# Altium schematic sheet SOCPowerDecoupling.SchDoc
size A3; SheetNumber: 6; SheetTotal: 18
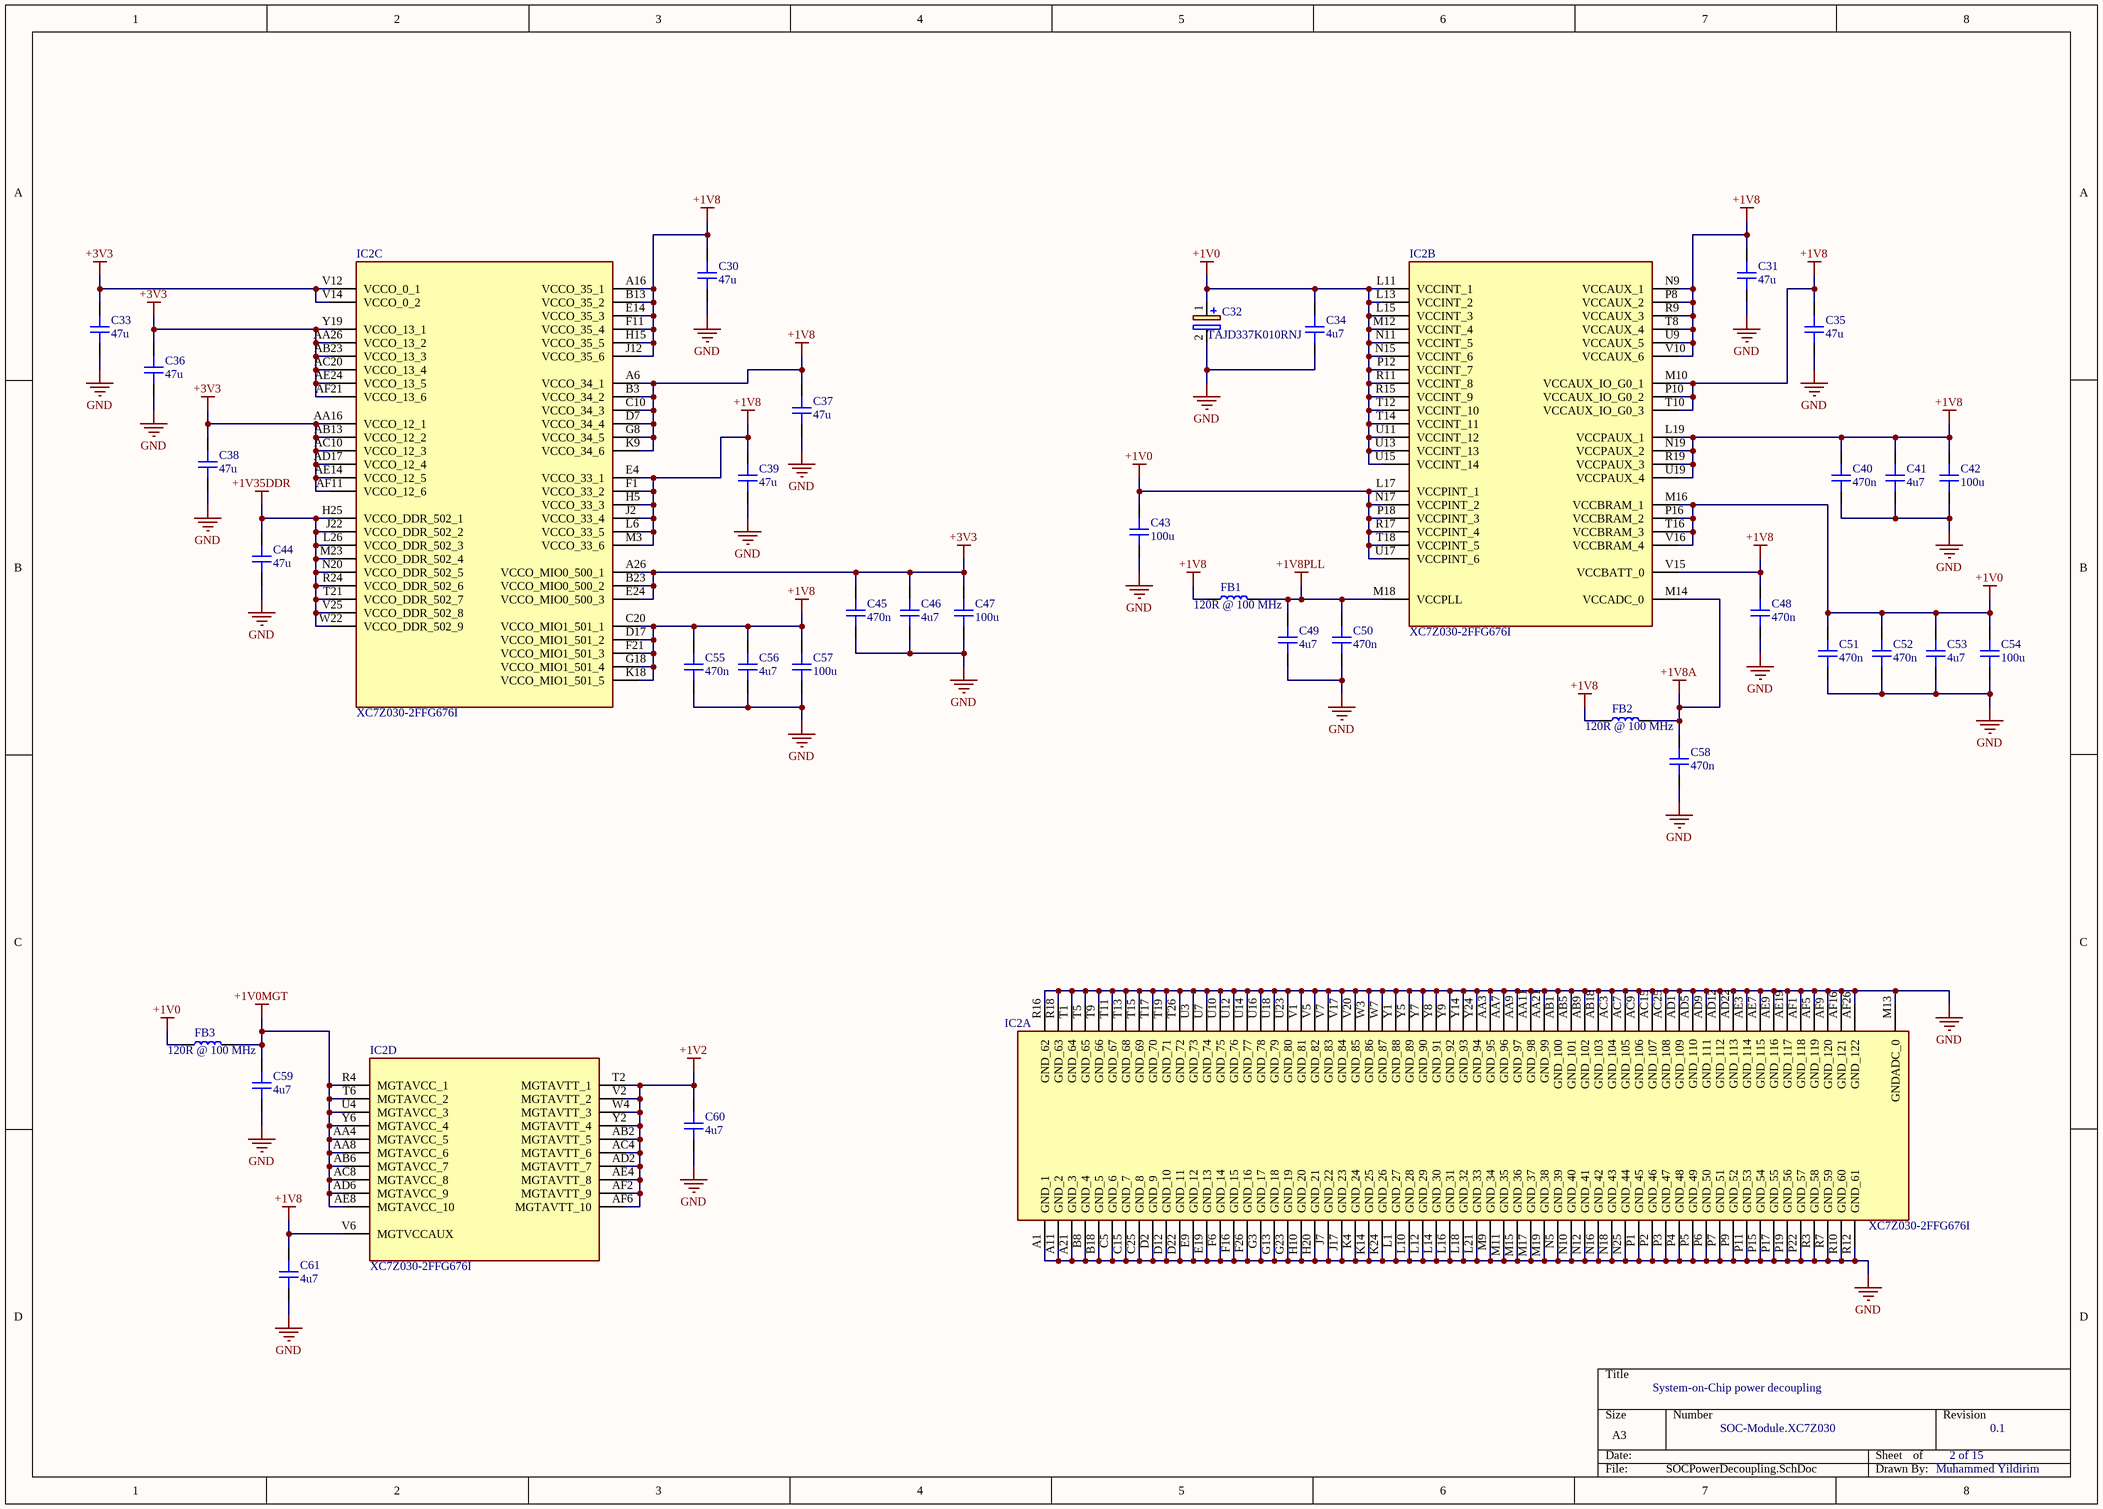
[diagram p0: SOCPowerDecoupling.SchDoc]

## Parts
C30  47u  [CAP_0805]
C31  47u  [CAP_0805]
C32  TAJD337K010RNJ  [CAPPM7344X310N]
C33  47u  [CAP_0805]
C34  4u7  [CAP_0402]
C35  47u  [CAP_0805]
C36  47u  [CAP_0805]
C37  47u  [CAP_0805]
C38  47u  [CAP_0805]
C39  47u  [CAP_0805]
C40  470n  [CAP_0201]
C41  4u7  [CAP_0402]
C42  100u  [CAP_1210]
C43  100u  [CAP_1210]
C44  47u  [CAP_0805]
C45  470n  [CAP_0201]
C46  4u7  [CAP_0402]
C47  100u  [CAP_1210]
C48  470n  [CAP_0201]
C49  4u7  [CAP_0402]
C50  470n  [CAP_0201]
C51  470n  [CAP_0201]
C52  470n  [CAP_0201]
C53  4u7  [CAP_0402]
C54  100u  [CAP_1210]
C55  470n  [CAP_0201]
C56  4u7  [CAP_0402]
C57  100u  [CAP_1210]
C58  470n  [CAP_0201]
C59  4u7  [CAP_0402]
C60  4u7  [CAP_0402]
C61  4u7  [CAP_0402]
FB1  120R @ 100 MHz  [IND_0201]
FB2  120R @ 100 MHz  [IND_0201]
FB3  120R @ 100 MHz  [IND_0201]
IC2  XC7Z030-2FFG676I  [BGA676C100P26X26_2700X2700X324]  (parts A,B,C,D of 15)

## Nets
+1V0: C32.1(+) C34.2 C43.2 C51.2 C52.2 C53.2 C54.2 FB3.1 IC2.L11(VCCINT_1) IC2.L13(VCCINT_2) IC2.L15(VCCINT_3) IC2.L17(VCCPINT_1) IC2.M12(VCCINT_4) IC2.M16(VCCBRAM_1) IC2.N11(VCCINT_5) IC2.N15(VCCINT_6) IC2.N17(VCCPINT_2) IC2.P12(VCCINT_7) IC2.P16(VCCBRAM_2) IC2.P18(VCCPINT_3) IC2.R11(VCCINT_8) IC2.R15(VCCINT_9) IC2.R17(VCCPINT_4) IC2.T12(VCCINT_10) IC2.T14(VCCINT_11) IC2.T16(VCCBRAM_3) IC2.T18(VCCPINT_5) IC2.U11(VCCINT_12) IC2.U13(VCCINT_13) IC2.U15(VCCINT_14) IC2.U17(VCCPINT_6) IC2.V16(VCCBRAM_4)
+1V0MGT: C59.2 FB3.2 IC2.AA4(MGTAVCC_5) IC2.AA8(MGTAVCC_6) IC2.AB6(MGTAVCC_7) IC2.AC8(MGTAVCC_8) IC2.AD6(MGTAVCC_9) IC2.AE8(MGTAVCC_10) IC2.R4(MGTAVCC_1) IC2.T6(MGTAVCC_2) IC2.U4(MGTAVCC_3) IC2.Y6(MGTAVCC_4)
+1V2: C60.2 IC2.AB2(MGTAVTT_5) IC2.AC4(MGTAVTT_6) IC2.AD2(MGTAVTT_7) IC2.AE4(MGTAVTT_8) IC2.AF2(MGTAVTT_9) IC2.AF6(MGTAVTT_10) IC2.T2(MGTAVTT_1) IC2.V2(MGTAVTT_2) IC2.W4(MGTAVTT_3) IC2.Y2(MGTAVTT_4)
+1V8: C30.2 C31.2 C35.2 C37.2 C39.2 C40.2 C41.2 C42.2 C48.2 C55.2 C56.2 C57.2 C61.2 FB1.1 FB2.1 IC2.A6(VCCO_34_1) IC2.A16(VCCO_35_1) IC2.B3(VCCO_34_2) IC2.B13(VCCO_35_2) IC2.C10(VCCO_34_3) IC2.C20(VCCO_MIO1_501_1) IC2.D7(VCCO_34_4) IC2.D17(VCCO_MIO1_501_2) IC2.E4(VCCO_33_1) IC2.E14(VCCO_35_3) IC2.F1(VCCO_33_2) IC2.F11(VCCO_35_4) IC2.F21(VCCO_MIO1_501_3) IC2.G8(VCCO_34_5) IC2.G18(VCCO_MIO1_501_4) IC2.H5(VCCO_33_3) IC2.H15(VCCO_35_5) IC2.J2(VCCO_33_4) IC2.J12(VCCO_35_6) IC2.K9(VCCO_34_6) IC2.K18(VCCO_MIO1_501_5) IC2.L6(VCCO_33_5) IC2.L19(VCCPAUX_1) IC2.M3(VCCO_33_6) IC2.M10(VCCAUX_IO_G0_1) IC2.N9(VCCAUX_1) IC2.N19(VCCPAUX_2) IC2.P8(VCCAUX_2) IC2.P10(VCCAUX_IO_G0_2) IC2.R9(VCCAUX_3) IC2.R19(VCCPAUX_3) IC2.T8(VCCAUX_4) IC2.T10(VCCAUX_IO_G0_3) IC2.U9(VCCAUX_5) IC2.U19(VCCPAUX_4) IC2.V6(MGTVCCAUX) IC2.V10(VCCAUX_6) IC2.V15(VCCBATT_0)
+1V8A: C58.2 FB2.2 IC2.M14(VCCADC_0)
+1V8PLL: C49.2 C50.2 FB1.2 IC2.M18(VCCPLL)
+1V35DDR: C44.2 IC2.H25(VCCO_DDR_502_1) IC2.J22(VCCO_DDR_502_2) IC2.L26(VCCO_DDR_502_3) IC2.M23(VCCO_DDR_502_4) IC2.N20(VCCO_DDR_502_5) IC2.R24(VCCO_DDR_502_6) IC2.T21(VCCO_DDR_502_7) IC2.V25(VCCO_DDR_502_8) IC2.W22(VCCO_DDR_502_9)
+3V3: C33.2 C36.2 C38.2 C45.2 C46.2 C47.2 IC2.A26(VCCO_MIO0_500_1) IC2.AA16(VCCO_12_1) IC2.AA26(VCCO_13_2) IC2.AB13(VCCO_12_2) IC2.AB23(VCCO_13_3) IC2.AC10(VCCO_12_3) IC2.AC20(VCCO_13_4) IC2.AD17(VCCO_12_4) IC2.AE14(VCCO_12_5) IC2.AE24(VCCO_13_5) IC2.AF11(VCCO_12_6) IC2.AF21(VCCO_13_6) IC2.B23(VCCO_MIO0_500_2) IC2.E24(VCCO_MIO0_500_3) IC2.V12(VCCO_0_1) IC2.V14(VCCO_0_2) IC2.Y19(VCCO_13_1)
GND: C30.1 C31.1 C32.2(-) C33.1 C34.1 C35.1 C36.1 C37.1 C38.1 C39.1 C40.1 C41.1 C42.1 C43.1 C44.1 C45.1 C46.1 C47.1 C48.1 C49.1 C50.1 C51.1 C52.1 C53.1 C54.1 C55.1 C56.1 C57.1 C58.1 C59.1 C60.1 C61.1 IC2.A1(GND_1) IC2.A11(GND_2) IC2.A21(GND_3) IC2.AA3(GND_95) IC2.AA7(GND_96) IC2.AA9(GND_97) IC2.AA11(GND_98) IC2.AA21(GND_99) IC2.AB1(GND_100) IC2.AB5(GND_101) IC2.AB9(GND_102) IC2.AB18(GND_103) IC2.AC3(GND_104) IC2.AC7(GND_105) IC2.AC9(GND_106) IC2.AC15(GND_107) IC2.AC25(GND_108) IC2.AD1(GND_109) IC2.AD5(GND_110) IC2.AD9(GND_111) IC2.AD12(GND_112) IC2.AD22(GND_113) IC2.AE3(GND_114) IC2.AE7(GND_115) IC2.AE9(GND_116) IC2.AE19(GND_117) IC2.AF1(GND_118) IC2.AF5(GND_119) IC2.AF9(GND_120) IC2.AF16(GND_121) IC2.AF26(GND_122) IC2.B8(GND_4) IC2.B18(GND_5) IC2.C5(GND_6) IC2.C15(GND_7) IC2.C25(GND_8) IC2.D2(GND_9) IC2.D12(GND_10) IC2.D22(GND_11) IC2.E9(GND_12) IC2.E19(GND_13) IC2.F6(GND_14) IC2.F16(GND_15) IC2.F26(GND_16) IC2.G3(GND_17) IC2.G13(GND_18) IC2.G23(GND_19) IC2.H10(GND_20) IC2.H20(GND_21) IC2.J7(GND_22) IC2.J17(GND_23) IC2.K4(GND_24) IC2.K14(GND_25) IC2.K24(GND_26) IC2.L1(GND_27) IC2.L10(GND_28) IC2.L12(GND_29) IC2.L14(GND_30) IC2.L16(GND_31) IC2.L18(GND_32) IC2.L21(GND_33) IC2.M9(GND_34) IC2.M11(GND_35) IC2.M13(GNDADC_0) IC2.M15(GND_36) IC2.M17(GND_37) IC2.M19(GND_38) IC2.N5(GND_39) IC2.N10(GND_40) IC2.N12(GND_41) IC2.N16(GND_42) IC2.N18(GND_43) IC2.N25(GND_44) IC2.P1(GND_45) IC2.P2(GND_46) IC2.P3(GND_47) IC2.P4(GND_48) IC2.P5(GND_49) IC2.P6(GND_50) IC2.P7(GND_51) IC2.P9(GND_52) IC2.P11(GND_53) IC2.P15(GND_54) IC2.P17(GND_55) IC2.P19(GND_56) IC2.P22(GND_57) IC2.R3(GND_58) IC2.R7(GND_59) IC2.R10(GND_60) IC2.R12(GND_61) IC2.R16(GND_62) IC2.R18(GND_63) IC2.T1(GND_64) IC2.T5(GND_65) IC2.T9(GND_66) IC2.T11(GND_67) IC2.T13(GND_68) IC2.T15(GND_69) IC2.T17(GND_70) IC2.T19(GND_71) IC2.T26(GND_72) IC2.U3(GND_73) IC2.U7(GND_74) IC2.U10(GND_75) IC2.U12(GND_76) IC2.U14(GND_77) IC2.U16(GND_78) IC2.U18(GND_79) IC2.U23(GND_80) IC2.V1(GND_81) IC2.V5(GND_82) IC2.V7(GND_83) IC2.V17(GND_84) IC2.V20(GND_85) IC2.W3(GND_86) IC2.W7(GND_87) IC2.Y1(GND_88) IC2.Y5(GND_89) IC2.Y7(GND_90) IC2.Y8(GND_91) IC2.Y9(GND_92) IC2.Y14(GND_93) IC2.Y24(GND_94)

## Notes on the sheet
- System-on-Chip power decoupling
- SOC-Module.XC7Z030
- 2 of 15
- 0.1
- Muhammed Yildirim

## Library data of the parts
C30 C31 C33 C35-C39 C44 = CAP_0805: Capacitor SMD 0805; Manufacturer: *; Manufacturer Part Number: *; Distributor Link: *; LCSC: *; Rating: *; Dielectric: *
C32 = TAJD337K010RNJ: 330 uF Tantalum Capacitor; Manufacturer_Name: KEMET; Manufacturer_Part_Number: T491A106M010AT; Datasheet Link: https://content.kemet.com/datasheets/KEM_T2005_T491.pdf; Height: 1.8mm; Mouser Part Number: 80-T491A106M010; Mouser Price/Stock: https://www.mouser.co.uk/ProductDetail/KEMET/T491A106M010AT?qs=VCf6WUQjPgG9lDvYXR0yBw%3D%3D; Arrow Part Number: T491A106M010AT; Arrow Price/Stock: https://www.arrow.com/en/products/t491a106m010at/kemet-corporation?region=nac
C34 C41 C46 C49 C53 C56 C59-C61 = CAP_0402: Capacitor SMD 0402; Manufacturer: *; Manufacturer Part Number: *; Distributor Link: *; LCSC: *; Rating: *; Dielectric: *
C40 C45 C48 C50-C52 C55 C58 = CAP_0201: Capacitor SMD 0201; Manufacturer: *; Manufacturer Part Number: *; Distributor Link: *; LCSC: *; Rating: *; Dielectric: *
C42 C43 C47 C54 C57 = CAP_1210: Capacitor SMD 1210; Manufacturer: *; Manufacturer Part Number: *; Distributor Link: *; LCSC: *; Rating: *; Dielectric: *
FB1-FB3 = IND_0201: Inductor SMD 0201; Manufacturer_Name: Murata Electronics; Manufacturer_Part_Number: LQP03HQ56NH02D; Datasheet Link: https://psearch.en.murata.com/inductor/product/LQP03HQ56NH02%23.html; Height: 0.42mm; Mouser Part Number: 81-LQP03HQ56NH02D; Mouser Price/Stock: https://www.mouser.co.uk/ProductDetail/Murata-Electronics/LQP03HQ56NH02D?qs=B6kkDfuK7%2FBQu1Ob9%2FT2Bg%3D%3D
IC2 = XC7Z030-2FFG676I: Integrated Circuit; Manufacturer_Name: AMD; Datasheet Link: http://www.xilinx.com/support/documentation/data_sheets/ds190-Zynq-7000-Overview.pdf; Height: 3.24mm; Manufacturer_Part_Number: XC7Z030-2FFG676I; Mouser Part Number: 217-XC7Z030-2FFG676I; Mouser Price/Stock: https://www.mouser.co.uk/ProductDetail/Xilinx/XC7Z030-2FFG676I?qs=rrS6PyfT74cuZK5O3CSpmw%3D%3D